# Altium schematic sheet Blockdiagram.SchDoc
size A3
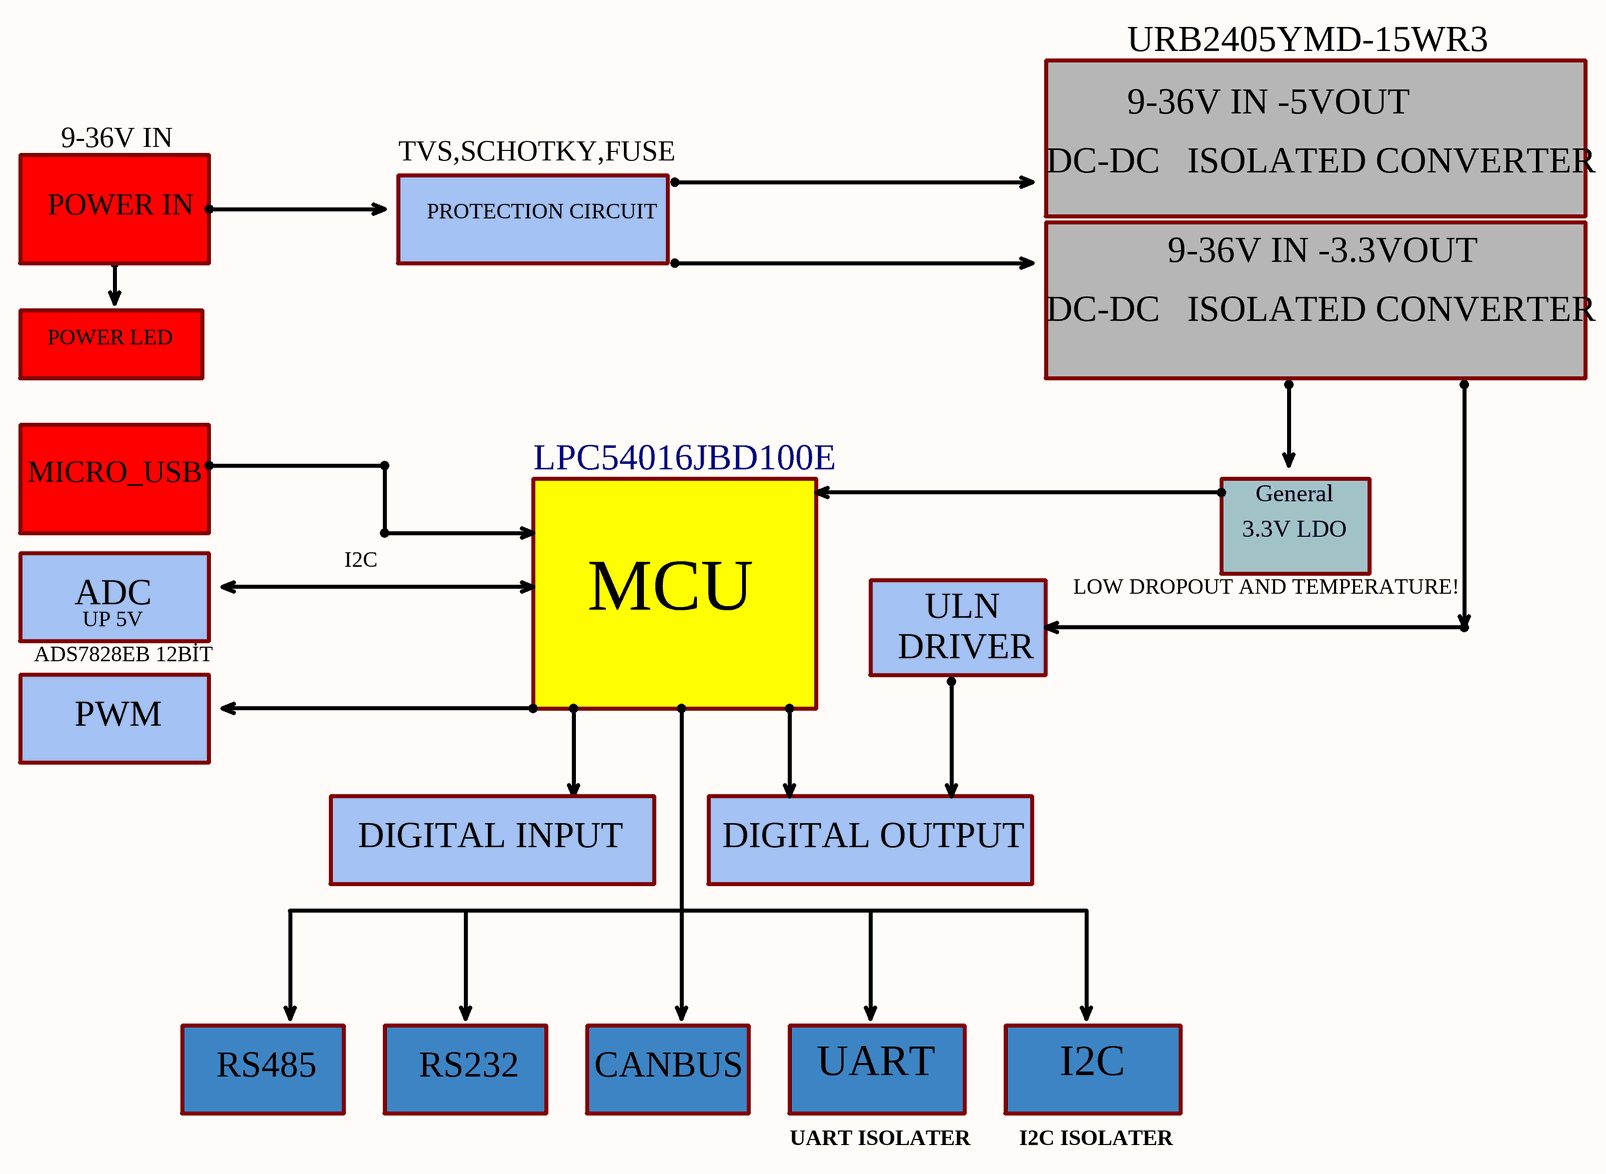
[diagram p0: Blockdiagram.SchDoc]

## Notes on the sheet
- URB2405YMD-15WR3
- 9-36V IN
- 9-36V IN -5VOUT
- POWER IN
- TVS,SCHOTKY,FUSE
- PROTECTION CIRCUIT
- DC-DC   ISOLATED CONVERTER
- 9-36V IN -3.3VOUT
- POWER LED
- MICRO_USB
- LPC54016JBD100E
- 3.3V LDO
- General
- ADC
- UP 5V
- I2C
- MCU
- ULN
- LOW DROPOUT AND TEMPERATURE!
- ADS7828EB 12BİT
- DRIVER
- PWM
- DIGITAL INPUT
- DIGITAL OUTPUT
- RS485
- RS232
- CANBUS
- UART
- UART ISOLATER
- I2C ISOLATER